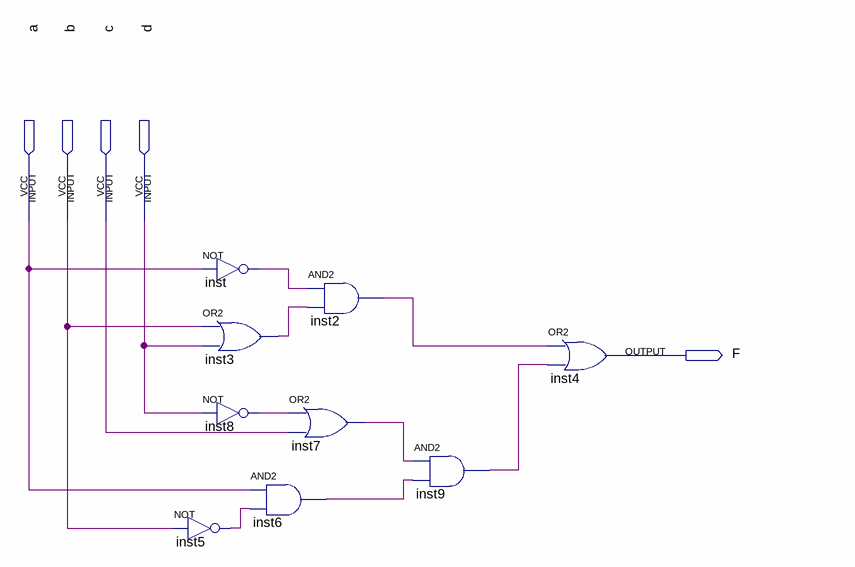
[diagram p0: schematic sheet]
// Quartus schematic Block3.bdf as structural Verilog: 9 symbols, 5 pins
module Block3 (
  input  a,
  input  b,
  input  c,
  input  d,
  output F
);

  wire inst2_out, inst3_out, inst5_out, inst6_out, inst7_out, inst8_out, inst9_out, inst_out;

  not inst (inst_out, a);
  or inst3 (inst3_out, b, d);
  not inst8 (inst8_out, d);
  not inst5 (inst5_out, b);
  and inst2 (inst2_out, inst_out, inst3_out);
  or inst7 (inst7_out, inst8_out, c);
  and inst6 (inst6_out, a, inst5_out);
  and inst9 (inst9_out, inst7_out, inst6_out);
  or inst4 (F, inst2_out, inst9_out);
endmodule
